# Altium schematic sheet [2] - WIDORA.SchDoc
size A3
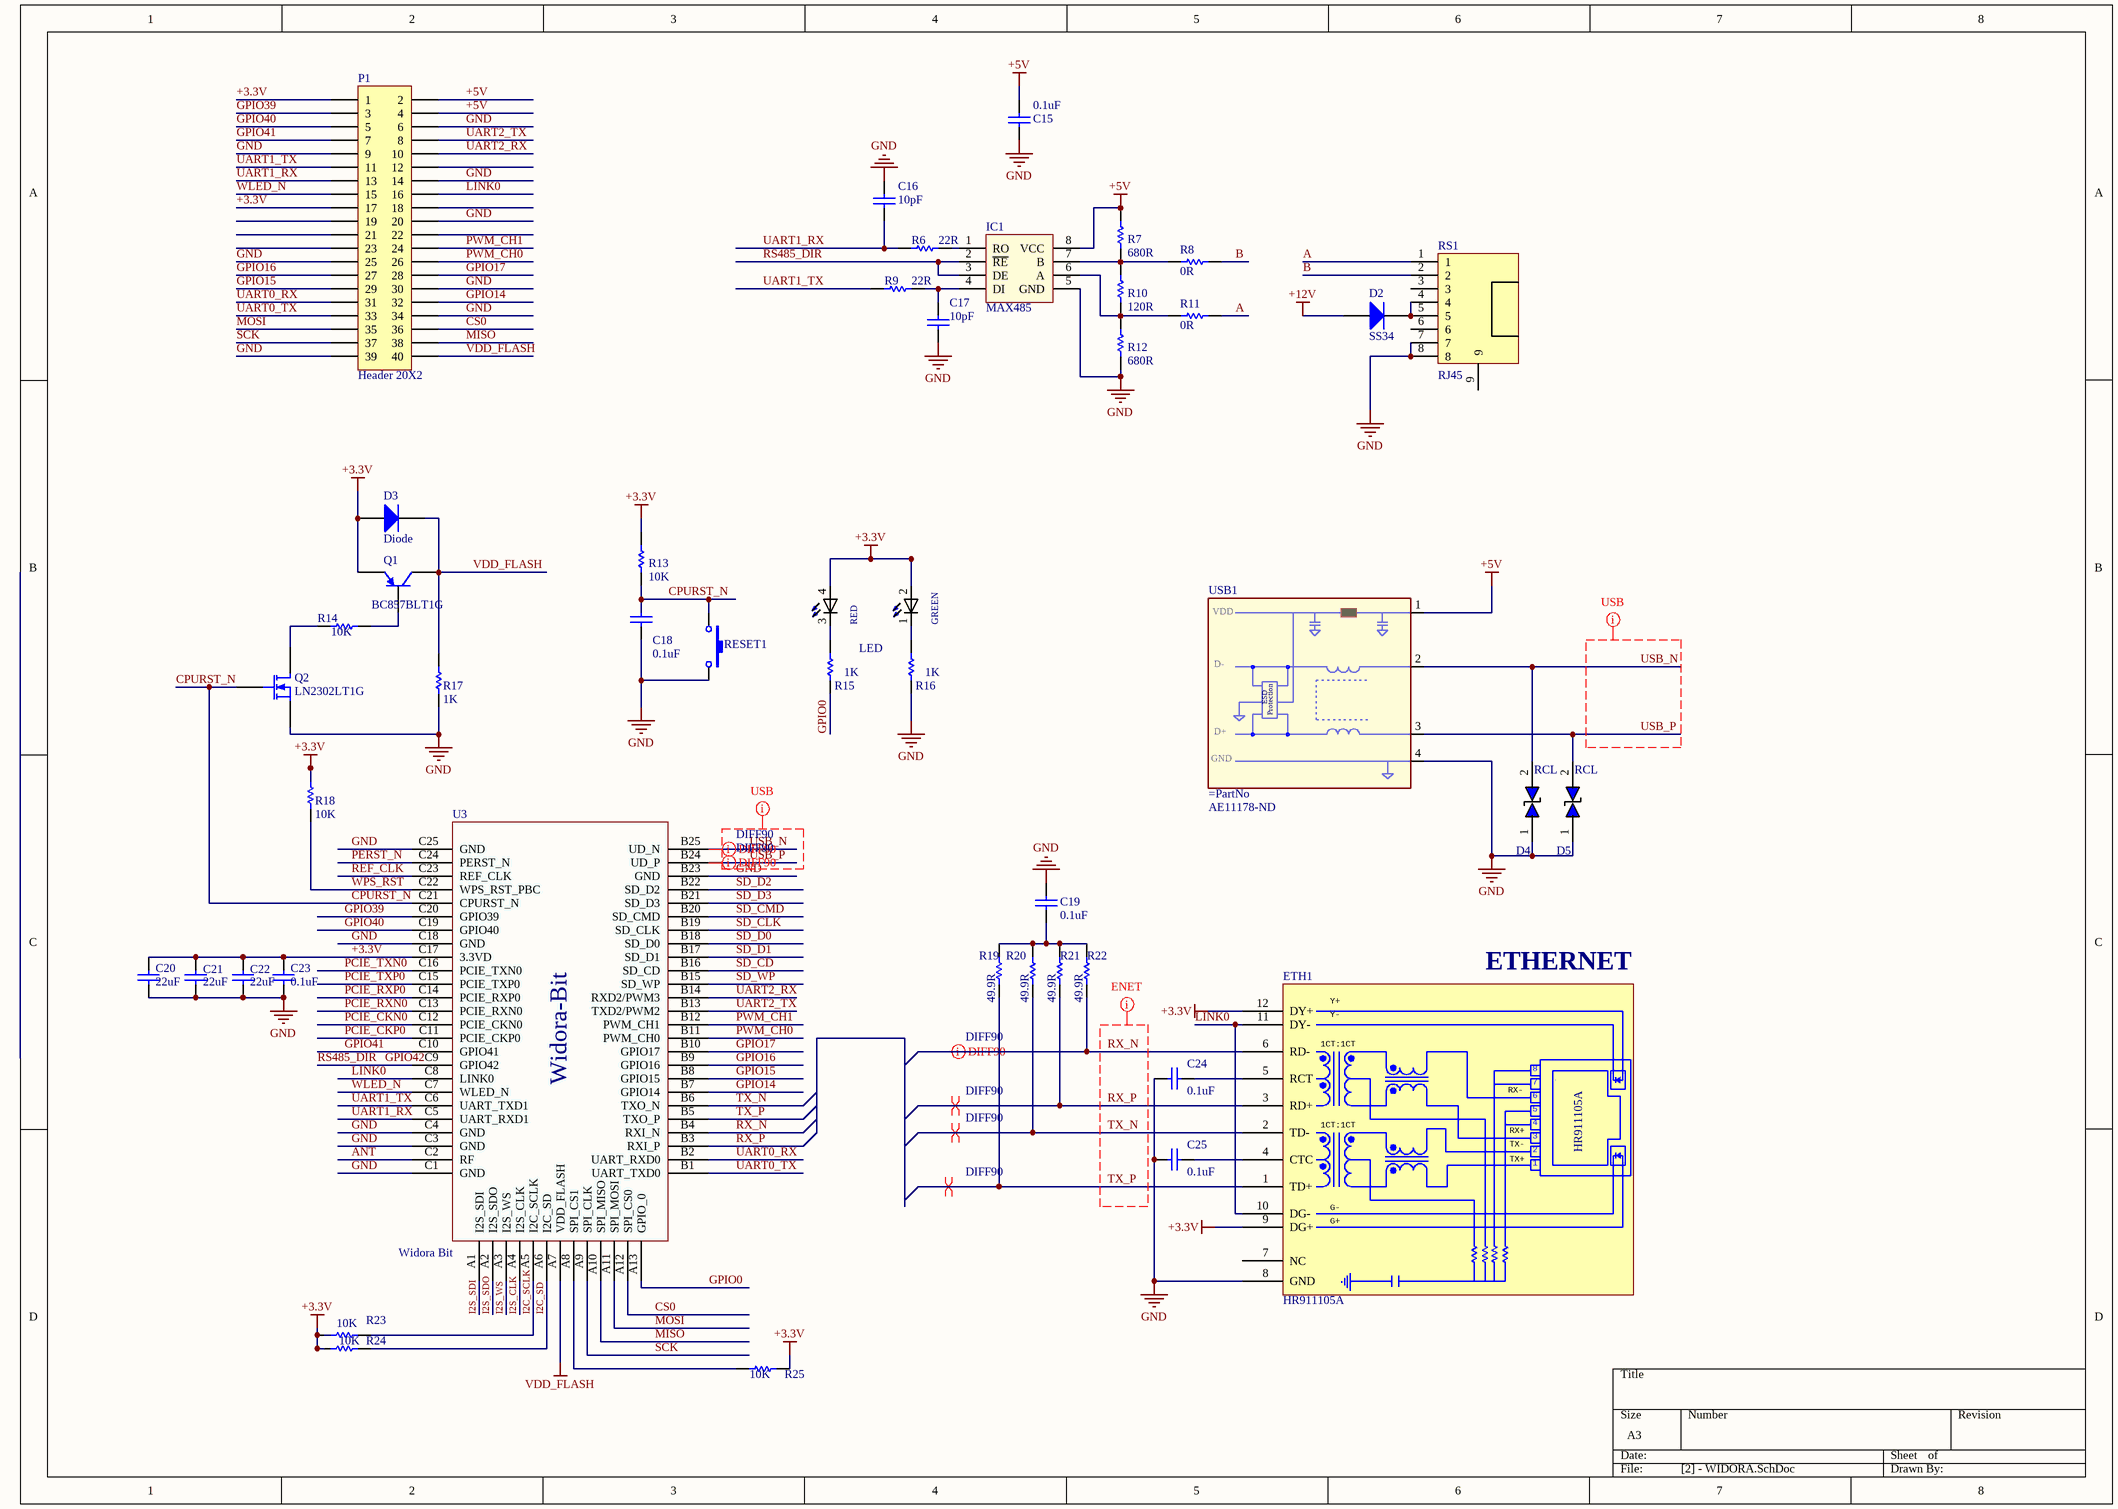
[diagram p0: [2] - WIDORA.SchDoc]

## Parts
C15  0.1uF  [CN-SMD-0603]
C16  10pF  [CN-SMD-0603]
C17  10pF  [CN-SMD-0603]
C18  0.1uF  [CN-SMD-0603]
C19  0.1uF  [CN-SMD-0603]
C20  22uF  [CN-SMD-0805]
C21  22uF  [CN-SMD-0805]
C22  22uF  [CN-SMD-0805]
C23  0.1uF  [CN-SMD-0603]
C24  0.1uF  [CN-SMD-0603]
C25  0.1uF  [CN-SMD-0603]
D2  SS34  [DO-214AC]
D3  Diode  [SOD323]
D4  RCL  [RES-0603]
D5  RCL  [RES-0603]
ETH1  HR911105A  [HR911105A]
IC1  MAX485  [SO8]
LED  122-000-04-52  [*122-000-04-52_122-000-04-52(Primary)]  (value not drawn)
P1  Header 20X2  [HDR2X20]
Q1  BC857BLT1G  [SOT-23B_L]
Q2  LN2302LT1G  [SOT-23B_L]
R6  22R  [RES 0603]
R7  680R  [RES 0603]
R8  0R  [RES 0603]
R9  22R  [RES 0603]
R10  120R  [RES 0603]
R11  0R  [RES 0603]
R12  680R  [RES 0603]
R13  10K  [RES 0603]
R14  10K  [RES 0603]
R15  1K  [RES 0603]
R16  1K  [RES 0603]
R17  1K  [RES 0603]
R18  10K  [RES 0603]
R19  49.9R  [RES 0603]
R20  49.9R  [RES 0603]
R21  49.9R  [RES 0603]
R22  49.9R  [RES 0603]
R23  10K  [RES 0603]
R24  10K  [RES 0603]
R25  10K  [RES 0603]
RESET1  SW-SMD  [SW2-D2 - duplicate]  (value not drawn)
RS1  RJ45  [RJ45_8PIN_VOSAT_V2]
U3  Widora Bit  [WIDORA]
USB1  Supplier Part Number 1: AE11178-ND  [USB A Vertical]

## Nets
+3.3V: C20.2 C21.2 C22.2 C23.1 D3.1(A) ETH1.9(DG+) ETH1.12(DY+) LED.2(GA) LED.4(RA) P1.1 P1.17 Q1.2(E) R13.2 R18.2 R23.2 R24.2 R25.1 U3.C17(3.3VD)
+5V: C15.2 IC1.8(VCC) P1.2 P1.4 R7.2 USB1.1(VBUS)
+12V: D2.1(A)
GND: C15.1 C16.2 C17.2 C18.1 C19.2 C20.1 C21.1 C22.1 C23.2 C24.2 C25.2 D4.1 D5.1 ETH1.8(GND) IC1.5(GND) P1.6 P1.9 P1.14 P1.20 P1.25 P1.30 P1.34 P1.39 Q2.2(S) R12.1 R16.1 R17.1 RESET1.2 RS1.7 RS1.8 U3.B23(GND) U3.C1(GND) U3.C3(GND) U3.C4(GND) U3.C18(GND) U3.C25(GND) USB1.4(GND)
VDD_FLASH: D3.2(K) P1.40 Q1.3(C) R17.2 U3.A7(VDD_FLASH)
A: R11.2 RS1.1
ANT: U3.C2(RF)
B: R8.2 RS1.2
CPURST_N: C18.2 Q2.1(G) R13.1 RESET1.1 U3.C21(CPURST_N)
CS0: P1.36 U3.A12(SPI_CS0)
GPIO0: R15.1 U3.A13(GPIO_0)
GPIO14: P1.32 U3.B7(GPIO14)
GPIO15: P1.29 U3.B8(GPIO15)
GPIO16: P1.27 U3.B9(GPIO16)
GPIO17: P1.28 U3.B10(GPIO17)
GPIO39: P1.3 U3.C20(GPIO39)
GPIO40: P1.5 U3.C19(GPIO40)
GPIO41: P1.7 U3.C10(GPIO41)
GPIO42: IC1.2(~{RE}) IC1.3(DE) U3.C9(GPIO42)  [also labelled RS485_DIR]
I2C_SCLK: R23.1 U3.A5(I2C_SCLK)
I2C_SD: R24.1 U3.A6(I2C_SD)
I2S_CLK: U3.A4(I2S_CLK)
I2S_SDI: U3.A1(I2S_SDI)
I2S_SDO: U3.A2(I2S_SDO)
I2S_WS: U3.A3(I2S_WS)
LINK0: ETH1.10(DG-) ETH1.11(DY-) P1.16 U3.C8(LINK0)
MISO: P1.38 U3.A10(SPI_MISO)
MOSI: P1.35 U3.A11(SPI_MOSI)
PCIE_CKN0: U3.C12(PCIE_CKN0)
PCIE_CKP0: U3.C11(PCIE_CKP0)
PCIE_RXN0: U3.C13(PCIE_RXN0)
PCIE_RXP0: U3.C14(PCIE_RXP0)
PCIE_TXN0: U3.C16(PCIE_TXN0)
PCIE_TXP0: U3.C15(PCIE_TXP0)
PERST_N: U3.C24(PERST_N)
PWM_CH0: P1.26 U3.B11(PWM_CH0)
PWM_CH1: P1.24 U3.B12(PWM_CH1)
REF_CLK: U3.C23(REF_CLK)
RX_N: ETH1.6(RD-) R22.2 U3.B4(RXI_N)
RX_P: ETH1.3(RD+) R21.2 U3.B3(RXI_P)
SCK: P1.37 U3.A9(SPI_CLK)
SD_CD: U3.B16(SD_CD)
SD_CLK: U3.B19(SD_CLK)
SD_CMD: U3.B20(SD_CMD)
SD_D0: U3.B18(SD_D0)
SD_D1: U3.B17(SD_D1)
SD_D2: U3.B22(SD_D2)
SD_D3: U3.B21(SD_D3)
SD_WP: U3.B15(SD_WP)
TX_N: ETH1.2(TD-) R20.2 U3.B6(TXO_N)
TX_P: ETH1.1(TD+) R19.2 U3.B5(TXO_P)
UART0_RX: P1.31 U3.B2(UART_RXD0)
UART0_TX: P1.33 U3.B1(UART_TXD0)
UART1_RX: C16.1 P1.13 R6.2 U3.C5(UART_RXD1)
UART1_TX: P1.11 R9.2 U3.C6(UART_TXD1)
UART2_RX: P1.10 U3.B14(RXD2/PWM3)
UART2_TX: P1.8 U3.B13(TXD2/PWM2)
USB_N: D4.2 U3.B25(UD_N) USB1.2(D-)
USB_P: D5.2 U3.B24(UD_P) USB1.3(D+)
WLED_N: P1.15 U3.C7(WLED_N)
WPS_RST: R18.1 U3.C22(WPS_RST_PBC)
NetC17_1: C17.1 IC1.4(DI) R9.1
NetC19_1: C19.1 R19.1 R20.1 R21.1 R22.1
NetC24_1: C24.1 ETH1.5(RCT)
NetC25_1: C25.1 ETH1.4(CTC)
NetD2_2: D2.2(K) RS1.4 RS1.5
NetIC1_1: IC1.1(RO) R6.1
NetIC1_6: IC1.6(A) R10.1 R11.1 R12.2
NetIC1_7: IC1.7(B) R7.1 R8.1 R10.2
NetLED_1: LED.1(GC) R16.2
NetLED_3: LED.3(RC) R15.2
NetQ1_1: Q1.1(B) R14.2
NetQ2_3: Q2.3(D) R14.1
NetR25_2: R25.2 U3.A8(SPI_CS1)

Not connected (* = marked no-connect by the designer): ETH1 7(NC); P1 12 18 19 21 22 23; RS1 3 6 9

## Layout directives
differential pair; : DIFF90: RX_N, RX_P, TX_N, TX_P, USB_N, USB_P
net class ENET: RX_N, RX_P, TX_N, TX_P
mark named USB: USB_N, USB_P

## Notes on the sheet
- ETHERNET
- (in symbol 122-000-04-52) RED; GREEN
- (in symbol RJ45 - Tranfomer) Y+; Y-; 1CT:1CT; RX-; RX+; TX-; TX+; G-; G+
- (in symbol USB-4) VDD; ESD; Protection
- (in symbol Widora) Widora-Bit

## Library data of the parts
C15 C18 C19 C23-C25 = CN0603-0.1uF: CC0603KPX7R9BB104 0603 0.1 uF 50 V ±10% Tolerance X7R SMT Multilayer Ceramic Capacitor; Manufacturer 1: Yageo; Capacitance: 100nF; Voltage Rating: 50V; Supplier 1: Digi-Key; Manufacturer Part Number 1: CC0603KPX7R9BB104; Stock 1: 190619; Pricing 1: 1=0.10000, 10=0.06200, 100=0.02780, 500=0.01988, 1000=0.01562, 2500=0.01420, 5000=0.01306 (USD); Mount: Surface Mount; Case/Package: 0603; Number of Pins: 2; Weight: 7.1E-05oz; Case Code (Imperial): 0603; Case Code (Metric): 1608; Min Operating Temperature: -55°C; Max Operating Temperature: 125°C; Tolerance: 10%; Packaging: Tape and Reel; Dielectric: X7R; Voltage Rating (DC): 50V; Termination: SMD/SMT; Composition: Ceramic; Length: 1.6mm; Height: 0.8mm; Width: 0.031inch; Thickness: 0.035inch; Depth: 0.8mm; Radiation Hardening: No; Lead Free: Lead Free; Halogen Free: Halogen Free; ComponentLink1URL: https://datasheet.ciiva.com/26829/getdatasheetpartid-653026-26829414.pdf?src-supplier=Verical; ComponentLink1Description: https://datasheet.ciiva.com/26829/getdatasheetpartid-653026-26829414.pdf?src-supplier=Verical; ComponentLink2URL: http://datasheet.octopart.com/CC0603KPX7R9BB104-Yageo-datasheet-10883670.pdf; ComponentLink2Description: http://datasheet.octopart.com/CC0603KPX7R9BB104-Yageo-datasheet-10883670.pdf; ComponentLink3URL: http://datasheet.octopart.com/CC0603KPX7R9BB104-Yageo-datasheet-68298032.pdf?src-supplier=Future+Electronics; ComponentLink3Description: http://datasheet.octopart.com/CC0603KPX7R9BB104-Yageo-datasheet-68298032.pdf?src-supplier=Future+Electronics; ComponentLink4URL: http://datasheet.octopart.com/CC0603KPX7R9BB104-Yageo-datasheet-78855685.pdf?src-supplier=Future+Electronics; ComponentLink4Description: http://datasheet.octopart.com/CC0603KPX7R9BB104-Yageo-datasheet-78855685.pdf?src-supplier=Future+Electronics; ComponentLink5URL: http://datasheet.octopart.com/CC0603KPX7R9BB104-Yageo-datasheet-82288757.pdf?src-supplier=Future+Electronics; ComponentLink5Description: http://datasheet.octopart.com/CC0603KPX7R9BB104-Yageo-datasheet-82288757.pdf?src-supplier=Future+Electronics; ComponentLink6URL: http://datasheet.octopart.com/CC0603KPX7R9BB104-Yageo-datasheet-137700084.pdf?src-supplier=Future+Electronics; ComponentLink6Description: http://datasheet.octopart.com/CC0603KPX7R9BB104-Yageo-datasheet-137700084.pdf?src-supplier=Future+Electronics
C16 C17 = CN0603-10pF: CC0603JRNPO9BN100 Surface Mount Ceramic Multilayer Capacitor 10pF 5% C0G 50V 0603 Paper T/R; Manufacturer 1: Yageo; Insulation Resistance: 100GR; Temperature Coefficient: 30ppm/°C; Supplier 1: Digi-Key; Manufacturer Part Number 1: CC0603JRNPO9BN100; Stock 1: 337373; Pricing 1: 1=0.10000, 10=0.04100, 100=0.01830, 500=0.01310, 1000=0.01029 (USD); Mount: Surface Mount; Case/Package: 0603; Number of Pins: 2; Case Code (Metric): 1608; Case Code (Imperial): 0603; Min Operating Temperature: -55°C; Max Operating Temperature: 125°C; Capacitance: 10pF; Voltage Rating: 50V; Packaging: Tape and Reel; Tolerance: 5%; Dielectric: C0G; Voltage Rating (DC): 50V; Composition: Ceramic; Termination: SMD/SMT; Package Quantity: 1; Voltage: 50V; Length: 1.6mm; Height: 0.8mm; Width: 0.031inch; Thickness: 0.035inch; Depth: 0.8mm; Radiation Hardening: No; Lead Free: Lead Free; REACH SVHC: No SVHC; ComponentLink1URL: https://datasheet.ciiva.com/26862/getdatasheetpartid-403524-26862758.pdf?src-supplier=Verical; ComponentLink1Description: https://datasheet.ciiva.com/26862/getdatasheetpartid-403524-26862758.pdf?src-supplier=Verical; ComponentLink2URL: https://datasheet.ciiva.com/5789/1734582-5789616.pdf?src-supplier=Farnell; ComponentLink2Description: https://datasheet.ciiva.com/5789/1734582-5789616.pdf?src-supplier=Farnell; ComponentLink3URL: https://datasheet.ciiva.com/11786/0900766b8079c870-11786407.pdf?src-supplier=RSComponents; ComponentLink3Description: https://datasheet.ciiva.com/11786/0900766b8079c870-11786407.pdf?src-supplier=RSComponents; ComponentLink4URL: https://datasheet.ciiva.com/144/mlccorderingcode-144651.pdf?src-supplier=Digi-Key; ComponentLink4Description: https://datasheet.ciiva.com/144/mlccorderingcode-144651.pdf?src-supplier=Digi-Key; ComponentLink5URL: https://datasheet.ciiva.com/46430/1835847-46430150.pdf?src-supplier=Element14; ComponentLink5Description: https://datasheet.ciiva.com/46430/1835847-46430150.pdf?src-supplier=Element14; ComponentLink6URL: https://datasheet.ciiva.com/144/mlccorderingcode-144650.pdf?src-supplier=Digi-Key; ComponentLink6Description: https://datasheet.ciiva.com/144/mlccorderingcode-144650.pdf?src-supplier=Digi-Key; ComponentLink7URL: https://datasheet.ciiva.com/8033/1734582-8033706.pdf?src-supplier=Element14; ComponentLink7Description: https://datasheet.ciiva.com/8033/1734582-8033706.pdf?src-supplier=Element14; ComponentLink8URL: https://datasheet.ciiva.com/16625/upy-gp-np0-16v-to-50v-8-16625514.pdf?src-supplier=Avnet+Europe; ComponentLink8Description: https://datasheet.ciiva.com/16625/upy-gp-np0-16v-to-50v-8-16625514.pdf?src-supplier=Avnet+Europe; ComponentLink9URL: https://datasheet.ciiva.com/5425/upy-gp-np0-16v-to-50v-8-5425564.pdf?src-supplier=Mouser; ComponentLink9Description: https://datasheet.ciiva.com/5425/upy-gp-np0-16v-to-50v-8-5425564.pdf?src-supplier=Mouser; ComponentLink10URL: https://datasheet.ciiva.com/7978/1132289-7978126.pdf?src-supplier=Element14; ComponentLink10Description: https://datasheet.ciiva.com/7978/1132289-7978126.pdf?src-supplier=Element14; ComponentLink11URL: https://datasheet.ciiva.com/8033/1734582-8033710.pdf?src-supplier=Element14; ComponentLink11Description: https://datasheet.ciiva.com/8033/1734582-8033710.pdf?src-supplier=Element14; ComponentLink12URL: https://datasheet.ciiva.com/144/mlccorderingcode-144649.pdf?src-supplier=Digi-Key; ComponentLink12Description: https://datasheet.ciiva.com/144/mlccorderingcode-144649.pdf?src-supplier=Digi-Key; ComponentLink13URL: http://datasheet.octopart.com/CC0603JRNPO9BN100-Yageo-datasheet-136957424.pdf?src-supplier=Future+Electronics; ComponentLink13Description: http://datasheet.octopart.com/CC0603JRNPO9BN100-Yageo-datasheet-136957424.pdf?src-supplier=Future+Electronics; ComponentLink14URL: http://datasheet.octopart.com/CC0603JRNPO9BN100-Yageo-datasheet-137700082.pdf?src-supplier=Future+Electronics; ComponentLink14Description: http://datasheet.octopart.com/CC0603JRNPO9BN100-Yageo-datasheet-137700082.pdf?src-supplier=Future+Electronics; ComponentLink15URL: http://datasheet.octopart.com/CC0603JRNPO9BN100-Yageo-datasheet-10406438.pdf?src-supplier=Element14; ComponentLink15Description: http://datasheet.octopart.com/CC0603JRNPO9BN100-Yageo-datasheet-10406438.pdf?src-supplier=Element14; ComponentLink16URL: http://datasheet.octopart.com/CC0603JRNPO9BN100-Yageo-datasheet-504625.pdf?src-supplier=Newark; ComponentLink16Description: http://datasheet.octopart.com/CC0603JRNPO9BN100-Yageo-datasheet-504625.pdf?src-supplier=Newark; ComponentLink17URL: http://datasheet.octopart.com/CC0603JRNPO9BN100-Yageo-datasheet-65873193.pdf?src-supplier=Element14; ComponentLink17Description: http://datasheet.octopart.com/CC0603JRNPO9BN100-Yageo-datasheet-65873193.pdf?src-supplier=Element14; ComponentLink18URL: http://datasheet.octopart.com/CC0603JRNPO9BN100-Yageo-datasheet-10882999.pdf?src-supplier=Element14; ComponentLink18Description: http://datasheet.octopart.com/CC0603JRNPO9BN100-Yageo-datasheet-10882999.pdf?src-supplier=Element14; ComponentLink19URL: http://datasheet.octopart.com/CC0603JRNPO9BN100-Yageo-datasheet-67645495.pdf?src-supplier=Element14; ComponentLink19Description: http://datasheet.octopart.com/CC0603JRNPO9BN100-Yageo-datasheet-67645495.pdf?src-supplier=Element14; ComponentLink20URL: http://datasheet.octopart.com/CC0603JRNPO9BN100-Yageo-datasheet-5321569.pdf?src-supplier=Newark; ComponentLink20Description: http://datasheet.octopart.com/CC0603JRNPO9BN100-Yageo-datasheet-5321569.pdf?src-supplier=Newark; ComponentLink21URL: http://datasheet.octopart.com/CC0603JRNPO9BN100-Yageo-datasheet-15895757.pdf?src-supplier=Future+Electronics; ComponentLink21Description: http://datasheet.octopart.com/CC0603JRNPO9BN100-Yageo-datasheet-15895757.pdf?src-supplier=Future+Electronics; ComponentLink22URL: http://datasheet.octopart.com/CC0603JRNPO9BN100-Yageo-datasheet-24578986.pdf?src-supplier=Future+Electronics; ComponentLink22Description: http://datasheet.octopart.com/CC0603JRNPO9BN100-Yageo-datasheet-24578986.pdf?src-supplier=Future+Electronics; ComponentLink23URL: http://datasheet.octopart.com/CC0603JRNPO9BN100-Yageo-datasheet-8555986.pdf?src-supplier=TME; ComponentLink23Description: http://datasheet.octopart.com/CC0603JRNPO9BN100-Yageo-datasheet-8555986.pdf?src-supplier=TME; ComponentLink24URL: http://datasheet.octopart.com/CC0603JRNPO9BN100-Yageo-datasheet-62091628.pdf?src-supplier=Future+Electronics; ComponentLink24Description: http://datasheet.octopart.com/CC0603JRNPO9BN100-Yageo-datasheet-62091628.pdf?src-supplier=Future+Electronics; ComponentLink25URL: http://datasheet.octopart.com/CC0603JRNPO9BN100-Yageo-datasheet-78855684.pdf?src-supplier=Future+Electronics; ComponentLink25Description: http://datasheet.octopart.com/CC0603JRNPO9BN100-Yageo-datasheet-78855684.pdf?src-supplier=Future+Electronics; ComponentLink26URL: http://datasheet.octopart.com/CC0603JRNPO9BN100-Yageo-datasheet-8324240.pdf?src-supplier=Element14; ComponentLink26Description: http://datasheet.octopart.com/CC0603JRNPO9BN100-Yageo-datasheet-8324240.pdf?src-supplier=Element14; ComponentLink27URL: http://datasheet.octopart.com/CC0603JRNPO9BN100-Yageo-datasheet-8817079.pdf?src-supplier=Element14; ComponentLink27Description: http://datasheet.octopart.com/CC0603JRNPO9BN100-Yageo-datasheet-8817079.pdf?src-supplier=Element14; ComponentLink28URL: http://datasheet.octopart.com/CC0603JRNPO9BN100-Yageo-datasheet-12589826.pdf?src-supplier=Future+Electronics; ComponentLink28Description: http://datasheet.octopart.com/CC0603JRNPO9BN100-Yageo-datasheet-12589826.pdf?src-supplier=Future+Electronics; ComponentLink29URL: http://datasheet.octopart.com/CC0603JRNPO9BN100-Yageo-datasheet-16730043.pdf?src-supplier=Future+Electronics; ComponentLink29Description: http://datasheet.octopart.com/CC0603JRNPO9BN100-Yageo-datasheet-16730043.pdf?src-supplier=Future+Electronics
C20-C22 = CN0805-22uF: CC0805MKX5R6BB226 0805 22 uF 10 V ±20 % Tolerance X5R SMT Multilayer Ceramic Capacitor; Manufacturer 1: Yageo; Tolerance: 20%; Voltage Rating: 10V; Supplier 1: Digi-Key; Manufacturer Part Number 1: CC0805MKX5R6BB226; Stock 1: 18000; Pricing 1: 1=0.41000, 10=0.28800, 100=0.17290, 500=0.12966, 1000=0.10950 (USD); Mount: Surface Mount; Case/Package: 0805; Weight: 0.000194oz; Case Code (Imperial): 0805; Case Code (Metric): 2012; Min Operating Temperature: -55°C; Max Operating Temperature: 85°C; Capacitance: 22uF; Packaging: Tape and Reel; Dielectric: X5R; Voltage Rating (DC): 10V; Termination: SMD/SMT; Composition: Ceramic; Length: 2mm; Width: 1.25mm; Thickness: 0.057inch; Depth: 1.25mm; Radiation Hardening: No; Lead Free: Lead Free; Halogen Free: Halogen Free; ComponentLink1URL: https://datasheet.ciiva.com/26863/getdatasheetpartid-573628-26863004.pdf?src-supplier=Verical; ComponentLink1Description: https://datasheet.ciiva.com/26863/getdatasheetpartid-573628-26863004.pdf?src-supplier=Verical; ComponentLink2URL: http://datasheet.octopart.com/CC0805MKX5R6BB226-Yageo-datasheet-24580494.pdf?src-supplier=Future+Electronics; ComponentLink2Description: http://datasheet.octopart.com/CC0805MKX5R6BB226-Yageo-datasheet-24580494.pdf?src-supplier=Future+Electronics; ComponentLink3URL: http://datasheet.octopart.com/CC0805MKX5R6BB226-Yageo-datasheet-27626583.pdf?src-supplier=Future+Electronics; ComponentLink3Description: http://datasheet.octopart.com/CC0805MKX5R6BB226-Yageo-datasheet-27626583.pdf?src-supplier=Future+Electronics; ComponentLink4URL: http://datasheet.octopart.com/CC0805MKX5R6BB226-Yageo-datasheet-86397281.pdf?src-supplier=Future+Electronics; ComponentLink4Description: http://datasheet.octopart.com/CC0805MKX5R6BB226-Yageo-datasheet-86397281.pdf?src-supplier=Future+Electronics
D2 = Diode_SS34: SS34 DIODE SCHOTTKY 40V 3A SMC; Manufacturer 1: ON Semiconductor / Fairchild; Element Configuration: Single; Peak Reverse Current: 500uA; Max Forward Surge Current (Ifsm): 100A; Forward Voltage: 500mV; Polarity: Standard; Max Power Dissipation: 2.27W; Number of Elements: 1; Supplier 1: Digi-Key; Manufacturer Part Number 1: SS34; Stock 1: 1630; Pricing 1: 1=0.47000, 10=0.40600, 100=0.30310, 500=0.23816, 1000=0.18403 (USD); RoHS: Yes; Mount: Surface Mount; Case/Package: SMC; Number of Pins: 2; Contact Plating: Tin,Matte; Number of Terminals: 2; Min Operating Temperature: -55°C; Max Operating Temperature: 150°C; Packaging: Tape and Reel; Package Quantity: 1; Current Rating: 3A; Voltage Rating (DC): 40V; Forward Current: 3A; Max Repetitive Reverse Voltage (Vrrm): 40V; Output Current: 3A; Peak Non-Repetitive Surge Current: 100A; Average Rectified Current: 3A; Max Reverse Voltage (DC): 40V; Max Surge Current: 100A; Max Reverse Leakage Current: 500uA; Current: 3A; Voltage: 40V; Length: 7.15mm; Height: 2.75mm; Width: 6.25mm; Radiation Hardening: No; Lead Free: Lead Free; REACH SVHC: No SVHC; ComponentLink1URL: https://datasheet.ciiva.com/911/ss34-911088.pdf?src-supplier=Avnet; ComponentLink1Description: https://datasheet.ciiva.com/911/ss34-911088.pdf?src-supplier=Avnet; ComponentLink2URL: https://datasheet.ciiva.com/4715/ss34-197057-4715255.pdf?src-supplier=Mouser; ComponentLink2Description: https://datasheet.ciiva.com/4715/ss34-197057-4715255.pdf?src-supplier=Mouser; ComponentLink3URL: https://datasheet.ciiva.com/34301/1090087-34301975.pdf?src-supplier=Jameco; ComponentLink3Description: https://datasheet.ciiva.com/34301/1090087-34301975.pdf?src-supplier=Jameco; ComponentLink4URL: https://datasheet.ciiva.com/23832/1725604-23832651.pdf?src-supplier=Newark; ComponentLink4Description: https://datasheet.ciiva.com/23832/1725604-23832651.pdf?src-supplier=Newark; ComponentLink5URL: https://datasheet.ciiva.com/34302/1547649-34302462.pdf?src-supplier=Jameco; ComponentLink5Description: https://datasheet.ciiva.com/34302/1547649-34302462.pdf?src-supplier=Jameco; ComponentLink6URL: https://datasheet.ciiva.com/911/ss34-911086.pdf?src-supplier=Digi-Key; ComponentLink6Description: https://datasheet.ciiva.com/911/ss34-911086.pdf?src-supplier=Digi-Key; ComponentLink7URL: https://datasheet.ciiva.com/8300/ss39-8300583.pdf?src-supplier=Avnet; ComponentLink7Description: https://datasheet.ciiva.com/8300/ss39-8300583.pdf?src-supplier=Avnet; ComponentLink8URL: https://datasheet.ciiva.com/911/ss34-911085.pdf?src-supplier=Digi-Key; ComponentLink8Description: https://datasheet.ciiva.com/911/ss34-911085.pdf?src-supplier=Digi-Key; ComponentLink9URL: https://datasheet.ciiva.com/7965/1774678-7965245.pdf?src-supplier=Element14; ComponentLink9Description: https://datasheet.ciiva.com/7965/1774678-7965245.pdf?src-supplier=Element14; ComponentLink10URL: https://datasheet.ciiva.com/911/ss34-911087.pdf?src-supplier=Digi-Key; ComponentLink10Description: https://datasheet.ciiva.com/911/ss34-911087.pdf?src-supplier=Digi-Key
D3 = Diode: Default Diode; pin to pad: 1>A 2>K; Published: 8-Jun-2000; LatestRevisionDate: 17-Jul-2002; LatestRevisionNote: Re-released for DXP Platform.; PackageVersion: Sep-1996; PackageReference: SMC; Publisher: Altium Limited; Code_JEDEC: DO-214-AB
D4 D5 = RCLAMP0531TQTCT: ESD Suppressor TVS Â±20KV 2-Pin SLP1006P2T T/R; MF: Semtech Corporation; MP: RCLAMP0531TQTCT; Package: 0402 Semtech; Availability: Unavailable; SnapEDA_Link: https://www.snapeda.com/parts/RCLAMP0531TQTCT/Semtech%20Corporation/view-part/?ref=snap; Price: None; Value: *
ETH1 = RJ45 - Tranfomer: Manufacturer: Hanrun; Suppiler 1: China; Manufacturer Part Number: HR911105A; Suppiler Part Number 1: HR911105A
IC1 = MAX485: RS232 - RS485 (Same sn75176)
LED = 122-000-04-52: LED, 3MM, PCB, BI-LEVEL, RED/GRN; LED / Lamp Size: 3mm / T-1; LED Colour: Green, Red; Viewing Angle: 30Â°; Forward Cur...; MF: Marl; Package: None; Availability: Unavailable; SnapEDA_Link: https://www.snapeda.com/parts/122-000-04-52/Marl/view-part/?ref=snap; Price: None; MP: 122-000-04-52; Value: *
P1 = Header 20X2: Header, 20-Pin, Dual row; LatestRevisionDate: 17-Jul-2002; LatestRevisionNote: Re-released for DXP Platform.; Publisher: Altium Limited
Q1 = BC857BLT1G: PNP Bipolar Transistor; Manufacturer: ON Semiconductor; Manufacturer Part Number: SBC857BLT1G; Max Power Dissipation: 300mW; Collector Emitter Voltage (VCEO): 45V; Max Collector Current: 100mA; Collector Base Voltage (VCBO): 50V; Frequency: 100MHz; Number of Elements: 1; Emitter Base Voltage (VEBO): 5V; Collector Emitter Saturation Voltage: -650mV; Element Configuration: Single; Supplier 1: Digi-Key; Stock 1: 19102; Pricing 1: 1 = 0.37000, 10 = 0.30200, 100 = 0.16030, 500 = 0.10544, 1000 = 0.07170 (USD); Case/Package: SOT-23-3; Number of Pins: 3; Min Operating Temperature: -55°C; Max Operating Temperature: 150°C; Package Quantity: 3000; Packaging: Tape and Reel; Transition Frequency: 100MHz; Polarity: PNP; Collector Emitter Breakdown Voltage: 45V; Max Breakdown Voltage: 45V; Power Dissipation: 300mW; Max Frequency: 100MHz; Length: 3.04mm; Height: 1.11mm; Width: 2.64mm; Radiation Hardening: No; Lead Free: Lead Free; ComponentLink1URL: https://datasheet.ciiva.com/16289/bc856alt1-d-91438-16289793.pdf?src-supplier=Mouser; ComponentLink1Description: https://datasheet.ciiva.com/16289/bc856alt1-d-91438-16289793.pdf?src-supplier=Mouser; ComponentLink2URL: https://datasheet.ciiva.com/980/bc856alt1-d-980919.pdf?src-supplier=Digi-Key; ComponentLink2Description: https://datasheet.ciiva.com/980/bc856alt1-d-980919.pdf?src-supplier=Digi-Key; ComponentLink3URL: https://datasheet.ciiva.com/11204/bc856alt1-d-11204892.pdf?src-supplier=Avnet; ComponentLink3Description: https://datasheet.ciiva.com/11204/bc856alt1-d-11204892.pdf?src-supplier=Avnet; ComponentLink4URL: http://datasheet.octopart.com/SBC857BLT1G-ON-Semiconductor-datasheet-547021.pdf?src-supplier=Future+Electronics; ComponentLink4Description: http://datasheet.octopart.com/SBC857BLT1G-ON-Semiconductor-datasheet-547021.pdf?src-supplier=Future+Electronics; ComponentLink5URL: http://datasheet.octopart.com/SBC857BLT1G-ON-Semiconductor-datasheet-7834531.pdf?src-supplier=Future+Electronics; ComponentLink5Description: http://datasheet.octopart.com/SBC857BLT1G-ON-Semiconductor-datasheet-7834531.pdf?src-supplier=Future+Electronics; ComponentLink6URL: http://datasheet.octopart.com/SBC857BLT1G-ON-Semiconductor-datasheet-522530.pdf?src-supplier=ON+Semiconductor; ComponentLink6Description: http://datasheet.octopart.com/SBC857BLT1G-ON-Semiconductor-datasheet-522530.pdf?src-supplier=ON+Semiconductor; ComponentLink7URL: http://datasheet.octopart.com/SBC857BLT1G-ON-Semiconductor-datasheet-24993137.pdf?src-supplier=Element14; ComponentLink7Description: http://datasheet.octopart.com/SBC857BLT1G-ON-Semiconductor-datasheet-24993137.pdf?src-supplier=Element14; ComponentLink8URL: http://datasheet.octopart.com/SBC857BLT1G-ON-Semiconductor-datasheet-11547404.pdf?src-supplier=Future+Electronics; ComponentLink8Description: http://datasheet.octopart.com/SBC857BLT1G-ON-Semiconductor-datasheet-11547404.pdf?src-supplier=Future+Electronics; Supplier Part Number 1: SBC857BLT1GOSCT-ND
Q2 = MOSFET-N: N-Channel MOSFET; Manufacturer: LRC; Suppiler 1: China; Manufacturer Part Number: LN2302LT1G; Suppiler Part Number 1: LN2302LT1G; Case/Package: SOT-23
R6 R9 = RC0603_22R: 311-22GRCT-ND Res Thick Film 0603 22 Ohm 5% 0.1W(1/10W) ±100ppm/C Pad SMD T/R; Manufacturer 1: Yageo; Manufacturer Part Number 1: RC0603JR-0722RL; Voltage Rating: 50V; Temperature Coefficient: 100ppm/°C; Power Rating: 100mW; Supplier 1: Digi-Key; Stock 1: 3749192; Pricing 1: 1=0.10000, 10=0.01900, 100=0.00770, 1000=0.00347, 2500=0.00301 (USD); Case/Package: 0603; Number of Pins: 2; Case Code (Imperial): 0603; Case Code (Metric): 1608; Min Operating Temperature: -55°C; Max Operating Temperature: 155°C; Tolerance: 5%; Packaging: Tape and Reel; Termination: SMD/SMT; Voltage Rating (DC): 50V; Composition: Thick Film; Resistance: 22R; Military Standard: Not; Length: 1.6mm; Width: 0.8mm; Depth: 0.8mm; Lead Free: Lead Free; REACH SVHC: No SVHC; ComponentLink1URL: https://datasheet.ciiva.com/15189/getdatasheetpartid-493085-15189862.pdf?src-supplier=Verical; ComponentLink1Description: https://datasheet.ciiva.com/15189/getdatasheetpartid-493085-15189862.pdf?src-supplier=Verical; ComponentLink2URL: https://datasheet.ciiva.com/7746/443971-7746471.pdf?src-supplier=Element14; ComponentLink2Description: https://datasheet.ciiva.com/7746/443971-7746471.pdf?src-supplier=Element14; ComponentLink3URL: https://datasheet.ciiva.com/46394/443971-46394999.pdf?src-supplier=Element14; ComponentLink3Description: https://datasheet.ciiva.com/46394/443971-46394999.pdf?src-supplier=Element14; ComponentLink4URL: https://datasheet.ciiva.com/7746/443971-7746472.pdf?src-supplier=Element14; ComponentLink4Description: https://datasheet.ciiva.com/7746/443971-7746472.pdf?src-supplier=Element14; ComponentLink5URL: http://datasheet.octopart.com/RC0603JR-0722RL-Yageo-datasheet-137700087.pdf?src-supplier=Future+Electronics; ComponentLink5Description: http://datasheet.octopart.com/RC0603JR-0722RL-Yageo-datasheet-137700087.pdf?src-supplier=Future+Electronics; ComponentLink6URL: http://datasheet.octopart.com/RC0603JR-0722RL-Yageo-datasheet-8328172.pdf?src-supplier=Newark; ComponentLink6Description: http://datasheet.octopart.com/RC0603JR-0722RL-Yageo-datasheet-8328172.pdf?src-supplier=Newark; ComponentLink7URL: http://datasheet.octopart.com/RC0603JR-0722RL-Yageo-datasheet-34211833.pdf?src-supplier=Newark; ComponentLink7Description: http://datasheet.octopart.com/RC0603JR-0722RL-Yageo-datasheet-34211833.pdf?src-supplier=Newark; ComponentLink8URL: http://datasheet.octopart.com/RC0603JR-0722RL-Yageo-datasheet-62067350.pdf?src-supplier=Element14; ComponentLink8Description: http://datasheet.octopart.com/RC0603JR-0722RL-Yageo-datasheet-62067350.pdf?src-supplier=Element14; ComponentLink9URL: http://datasheet.octopart.com/RC0603JR-0722RL-Yageo-datasheet-15599030.pdf?src-supplier=Seeed+Studio; ComponentLink9Description: http://datasheet.octopart.com/RC0603JR-0722RL-Yageo-datasheet-15599030.pdf?src-supplier=Seeed+Studio; ComponentLink10URL: http://datasheet.octopart.com/RC0603JR-0722RL-Yageo-datasheet-73766026.pdf; ComponentLink10Description: http://datasheet.octopart.com/RC0603JR-0722RL-Yageo-datasheet-73766026.pdf; ComponentLink11URL: http://datasheet.octopart.com/RC0603JR-0722RL-Yageo-datasheet-118562.pdf?src-supplier=Digi-Key; ComponentLink11Description: http://datasheet.octopart.com/RC0603JR-0722RL-Yageo-datasheet-118562.pdf?src-supplier=Digi-Key; ComponentLink12URL: http://datasheet.octopart.com/RC0603JR-0722RL-Yageo-datasheet-8324193.pdf?src-supplier=Future+Electronics; ComponentLink12Description: http://datasheet.octopart.com/RC0603JR-0722RL-Yageo-datasheet-8324193.pdf?src-supplier=Future+Electronics; ComponentLink13URL: http://datasheet.octopart.com/RC0603JR-0722RL-Yageo-datasheet-12596169.pdf?src-supplier=Future+Electronics; ComponentLink13Description: http://datasheet.octopart.com/RC0603JR-0722RL-Yageo-datasheet-12596169.pdf?src-supplier=Future+Electronics; ComponentLink14URL: http://datasheet.octopart.com/RC0603JR0722RL-Yageo-datasheet-27584510.pdf?src-supplier=Future+Electronics; ComponentLink14Description: http://datasheet.octopart.com/RC0603JR0722RL-Yageo-datasheet-27584510.pdf?src-supplier=Future+Electronics
R7 R12 = RC0603_680R: AC0603JR-07680RL Res Thick Film 0603 680 Ohm 5% 0.1W(1/10W) +/-100ppm/ßC Epoxy SMD Automotive T/R; Manufacturer 1: Yageo; Voltage Rating: 50V; Temperature Coefficient: 100ppm/°C; Max Power Dissipation: 100mW; Supplier 1: Digi-Key; Manufacturer Part Number 1: AC0603JR-07680RL; Stock 1: 5000; Pricing 1: 1=0.10000, 10=0.02300, 100=0.00940, 1000=0.00421, 2500=0.00366 (USD); Case/Package: 0603; Case Code (Imperial): 0603; Case Code (Metric): 1608; Contact Plating: Tin; Min Operating Temperature: -55°C; Max Operating Temperature: 155°C; Packaging: Tape and Reel; Tolerance: 5%; Termination: SMD/SMT; Composition: Thick Film; Resistance: 680R; Number of Terminations: 2; Features: Moisture Resistant; Power Rating: 100mW; Package Quantity: 1; Length: 0.063inch; Height: 0.022inch; Width: 0.8mm; Radiation Hardening: No; Lead Free: Lead Free; ComponentLink1URL: http://www.yageo.com/documents/recent/PYu-AC_51_RoHS_L_2.pdf?src-supplier=Mouser; ComponentLink1Description: http://www.yageo.com/documents/recent/PYu-AC_51_RoHS_L_2.pdf?src-supplier=Mouser; ComponentLink2URL: http://www.yageo.com/documents/recent/PYu-AC_51_RoHS_L_2_revised.pdf?src-supplier=Avnet+Europe; ComponentLink2Description: http://www.yageo.com/documents/recent/PYu-AC_51_RoHS_L_2_revised.pdf?src-supplier=Avnet+Europe; ComponentLink3URL: http://www.yageo.com/NewPortal/yageodocoutput?fileName=/pdf/R-Chip/PYu-AC_51_RoHS_L_6.pdf&src-supplier=Digi-Key; ComponentLink3Description: http://www.yageo.com/NewPortal/yageodocoutput?fileName=/pdf/R-Chip/PYu-AC_51_RoHS_L_6.pdf&src-supplier=Digi-Key; ComponentLink4URL: http://datasheet.octopart.com/AC0603JR-07680RL-Yageo-datasheet-12512238.pdf; ComponentLink4Description: http://datasheet.octopart.com/AC0603JR-07680RL-Yageo-datasheet-12512238.pdf; ComponentLink5URL: http://datasheet.octopart.com/AC0603JR-07680RL-Yageo-datasheet-86786639.pdf?src-supplier=Future+Electronics; ComponentLink5Description: http://datasheet.octopart.com/AC0603JR-07680RL-Yageo-datasheet-86786639.pdf?src-supplier=Future+Electronics; ComponentLink6URL: http://datasheet.octopart.com/AC0603JR-07680RL-Yageo-datasheet-128680548.pdf?src-supplier=X-ON; ComponentLink6Description: http://datasheet.octopart.com/AC0603JR-07680RL-Yageo-datasheet-128680548.pdf?src-supplier=X-ON; ComponentLink7URL: http://datasheet.octopart.com/AC0603JR-07680RL-Yageo-datasheet-137699919.pdf?src-supplier=Future+Electronics; ComponentLink7Description: http://datasheet.octopart.com/AC0603JR-07680RL-Yageo-datasheet-137699919.pdf?src-supplier=Future+Electronics
R8 R11 = RC0603_0R: AC0603JR-070RL Res Thick Film 0603 0 Ohm Jumper 1/10W Molded SMD Paper T/R; Manufacturer 1: Yageo; Resistance: 0mR; Tolerance: 1%; Power Rating: 100mW; Supplier 1: Digi-Key; Manufacturer Part Number 1: AC0603JR-070RL; Stock 1: 966373; Pricing 1: 1=0.10000, 10=0.02500, 25=0.01840, 50=0.01400, 100=0.01030, 250=0.00788, 500=0.00630, 1000=0.00463 (USD); Case/Package: 0603; Weight: 7.1E-05oz; Case Code (Metric): 1608; Case Code (Imperial): 0603; Min Operating Temperature: -55°C; Max Operating Temperature: 155°C; Packaging: Tape and Reel; Package Quantity: 1; Termination: SMD/SMT; Military Standard: Not; Composition: Thick Film; Number of Terminations: 2; Max Power Dissipation: 100mW; Features: Moisture Resistant; Length: 1.6mm; Height: 0.022inch; Width: 0.031inch; Depth: 0.8mm; Lead Free: Lead Free; ComponentLink1URL: https://datasheet.ciiva.com/5558/pyu-ac-51-rohs-l-2-5558237.pdf?src-supplier=Mouser; ComponentLink1Description: https://datasheet.ciiva.com/5558/pyu-ac-51-rohs-l-2-5558237.pdf?src-supplier=Mouser; ComponentLink2URL: http://datasheet.octopart.com/AC0603JR-070RL-Yageo-datasheet-12512238.pdf; ComponentLink2Description: http://datasheet.octopart.com/AC0603JR-070RL-Yageo-datasheet-12512238.pdf; ComponentLink3URL: http://datasheet.octopart.com/AC0603JR-070RL-Yageo-datasheet-13029202.pdf?src-supplier=Future+Electronics; ComponentLink3Description: http://datasheet.octopart.com/AC0603JR-070RL-Yageo-datasheet-13029202.pdf?src-supplier=Future+Electronics; ComponentLink4URL: http://datasheet.octopart.com/AC0603JR-070RL-Yageo-datasheet-24580492.pdf?src-supplier=Future+Electronics; ComponentLink4Description: http://datasheet.octopart.com/AC0603JR-070RL-Yageo-datasheet-24580492.pdf?src-supplier=Future+Electronics; ComponentLink5URL: http://datasheet.octopart.com/AC0603JR-070RL-Yageo-datasheet-83209224.pdf?src-supplier=Future+Electronics; ComponentLink5Description: http://datasheet.octopart.com/AC0603JR-070RL-Yageo-datasheet-83209224.pdf?src-supplier=Future+Electronics; ComponentLink6URL: http://datasheet.octopart.com/AC0603JR-070RL-Yageo-datasheet-137699919.pdf?src-supplier=Future+Electronics; ComponentLink6Description: http://datasheet.octopart.com/AC0603JR-070RL-Yageo-datasheet-137699919.pdf?src-supplier=Future+Electronics; Supplier Part Number 1: 0R
R10 = RC0603_120R: RC0603JR-07120RL Res Thick Film 0603 120 Ohm 5% 0.1W(1/10W) ±100ppm/C Pad SMD T/R; Manufacturer 1: Yageo; Voltage Rating (DC): 50V; Temperature Coefficient: 100ppm/°C; Power Rating: 100mW; Supplier 1: Newark; Manufacturer Part Number 1: RC0603JR-07120RL; Stock 1: 21749; Pricing 1: 1=0.100000, 10=0.100000, 25=0.015000, 50=0.010000, 100=0.005000, 250=0.005000, 500=0.004000, 1000=0.004000 (USD); Case/Package: 0603; Number of Pins: 2; Case Code (Metric): 1608; Case Code (Imperial): 0603; Min Operating Temperature: -55°C; Max Operating Temperature: 155°C; Tolerance: 5%; Packaging: Tape and Reel; Composition: Thick Film; Termination: SMD/SMT; Voltage Rating: 50V; Resistance: 120R; Package Quantity: 1; Number of Terminations: 2; Max Power Dissipation: 100mW; Military Standard: Not; Features: Moisture Resistant; Length: 1.6mm; Height: 0.022inch; Width: 0.8mm; Depth: 0.8mm; Lead Free: Lead Free; REACH SVHC: No SVHC; ComponentLink1URL: https://datasheet.ciiva.com/15189/getdatasheetpartid-326532-15189850.pdf?src-supplier=Verical; ComponentLink1Description: https://datasheet.ciiva.com/15189/getdatasheetpartid-326532-15189850.pdf?src-supplier=Verical; ComponentLink2URL: https://datasheet.ciiva.com/2518/pyu-r-int-thick-7-2518850.pdf?src-supplier=Digi-Key; ComponentLink2Description: https://datasheet.ciiva.com/2518/pyu-r-int-thick-7-2518850.pdf?src-supplier=Digi-Key; ComponentLink3URL: https://datasheet.ciiva.com/2518/pyu-r-int-thick-7-2518851.pdf?src-supplier=Digi-Key; ComponentLink3Description: https://datasheet.ciiva.com/2518/pyu-r-int-thick-7-2518851.pdf?src-supplier=Digi-Key; ComponentLink4URL: https://datasheet.ciiva.com/2518/pyu-r-int-thick-7-2518852.pdf?src-supplier=Digi-Key; ComponentLink4Description: https://datasheet.ciiva.com/2518/pyu-r-int-thick-7-2518852.pdf?src-supplier=Digi-Key; ComponentLink5URL: https://datasheet.ciiva.com/12555/rc0603-272842-12555246.pdf?src-supplier=Mouser; ComponentLink5Description: https://datasheet.ciiva.com/12555/rc0603-272842-12555246.pdf?src-supplier=Mouser; ComponentLink6URL: https://datasheet.ciiva.com/46395/443971-46395070.pdf?src-supplier=Element14; ComponentLink6Description: https://datasheet.ciiva.com/46395/443971-46395070.pdf?src-supplier=Element14; ComponentLink7URL: http://datasheet.octopart.com/RC0603JR-07120RL-Yageo-datasheet-137700087.pdf?src-supplier=Future+Electronics; ComponentLink7Description: http://datasheet.octopart.com/RC0603JR-07120RL-Yageo-datasheet-137700087.pdf?src-supplier=Future+Electronics; ComponentLink8URL: http://datasheet.octopart.com/RC0603JR-07120RL-Yageo-datasheet-8328172.pdf?src-supplier=Newark; ComponentLink8Description: http://datasheet.octopart.com/RC0603JR-07120RL-Yageo-datasheet-8328172.pdf?src-supplier=Newark; ComponentLink9URL: http://datasheet.octopart.com/RC0603JR-07120RL-Yageo-datasheet-62067350.pdf?src-supplier=Element14; ComponentLink9Description: http://datasheet.octopart.com/RC0603JR-07120RL-Yageo-datasheet-62067350.pdf?src-supplier=Element14; ComponentLink10URL: http://datasheet.octopart.com/RC0603JR-07120RL-Yageo-datasheet-34211833.pdf?src-supplier=Element14; ComponentLink10Description: http://datasheet.octopart.com/RC0603JR-07120RL-Yageo-datasheet-34211833.pdf?src-supplier=Element14; ComponentLink11URL: http://datasheet.octopart.com/RC0603JR-07120RL-Yageo-datasheet-12596169.pdf?src-supplier=Future+Electronics; ComponentLink11Description: http://datasheet.octopart.com/RC0603JR-07120RL-Yageo-datasheet-12596169.pdf?src-supplier=Future+Electronics; ComponentLink12URL: http://datasheet.octopart.com/RC0603JR-07120RL-Yageo-datasheet-27584510.pdf?src-supplier=Future+Electronics; ComponentLink12Description: http://datasheet.octopart.com/RC0603JR-07120RL-Yageo-datasheet-27584510.pdf?src-supplier=Future+Electronics; ComponentLink13URL: http://datasheet.octopart.com/RC0603JR-07120RL-Yageo-datasheet-73766026.pdf; ComponentLink13Description: http://datasheet.octopart.com/RC0603JR-07120RL-Yageo-datasheet-73766026.pdf; ComponentLink14URL: http://datasheet.octopart.com/RC0603JR-07120RL-Yageo-datasheet-118562.pdf?src-supplier=Digi-Key; ComponentLink14Description: http://datasheet.octopart.com/RC0603JR-07120RL-Yageo-datasheet-118562.pdf?src-supplier=Digi-Key; ComponentLink15URL: http://datasheet.octopart.com/RC0603JR-07120RL-Yageo-datasheet-8324193.pdf?src-supplier=Future+Electronics; ComponentLink15Description: http://datasheet.octopart.com/RC0603JR-07120RL-Yageo-datasheet-8324193.pdf?src-supplier=Future+Electronics; ComponentLink16URL: http://datasheet.octopart.com/RC0603JR-07120RL-Yageo-datasheet-15599030.pdf?src-supplier=Future+Electronics; ComponentLink16Description: http://datasheet.octopart.com/RC0603JR-07120RL-Yageo-datasheet-15599030.pdf?src-supplier=Future+Electronics
R13 R14 R18 R23-R25 = RC0603_10K: AC0603FR-0710KL Res Thick Film 0603 10K Ohm 1% 0.1W(1/10W) ±100ppm/C Pad SMD Automotive T/R; Manufacturer 1: Yageo; Resistance: 10kR; Temperature Coefficient: 100ppm/°C; Power Rating: 100mW; Voltage Rating: 50V; ComponentLink1URL: https://datasheet.ciiva.com/26862/getdatasheetpartid-724997-26862461.pdf?src-supplier=Verical; ComponentLink1Description: https://datasheet.ciiva.com/26862/getdatasheetpartid-724997-26862461.pdf?src-supplier=Verical; ComponentLink2URL: http://datasheet.octopart.com/AC0603FR-0710KL-Yageo-datasheet-12512238.pdf; ComponentLink2Description: http://datasheet.octopart.com/AC0603FR-0710KL-Yageo-datasheet-12512238.pdf; ComponentLink3URL: http://datasheet.octopart.com/AC0603FR-0710KL-Yageo-datasheet-13029202.pdf?src-supplier=Future+Electronics; ComponentLink3Description: http://datasheet.octopart.com/AC0603FR-0710KL-Yageo-datasheet-13029202.pdf?src-supplier=Future+Electronics; ComponentLink4URL: http://datasheet.octopart.com/AC0603FR-0710KL-Yageo-datasheet-24580492.pdf?src-supplier=Future+Electronics; ComponentLink4Description: http://datasheet.octopart.com/AC0603FR-0710KL-Yageo-datasheet-24580492.pdf?src-supplier=Future+Electronics; ComponentLink5URL: http://datasheet.octopart.com/AC0603FR-0710KL-Yageo-datasheet-137699919.pdf?src-supplier=Future+Electronics; ComponentLink5Description: http://datasheet.octopart.com/AC0603FR-0710KL-Yageo-datasheet-137699919.pdf?src-supplier=Future+Electronics; Supplier 1: Newark; Manufacturer Part Number 1: AC0603FR-0710KL; Stock 1: 0; Mount: Surface Mount; Case/Package: 0603; Case Code (Imperial): 0603; Case Code (Metric): 1608; Min Operating Temperature: -55°C; Max Operating Temperature: 155°C; Tolerance: 1%; Packaging: Tape and Reel; Military Standard: Not; Termination: SMD/SMT; Composition: Thick Film; Package Quantity: 1; Number of Terminations: 2; Max Power Dissipation: 100mW; Features: Moisture Resistant; Length: 1.6mm; Height: 0.022inch; Depth: 0.8mm; Width: 0.8mm; Lead Free: Lead Free; Supplier Part Number 1: 10K
R15-R17 = RC0603_1K: YC164-JR-071KL Res Thick Film Array 1KOhm 5% 200ppm/C ISOL Epoxy 8-Pin 1206(4 X 0603) Convex SMD T/R; Manufacturer 1: Yageo; Resistance: 1kR; Temperature Coefficient: 200ppm/°C; Voltage Rating: 50V; Number of Elements: 4; Circuit Type: Isolated; Power Per Element: 62.5mW; Number of Contacts: 8; ComponentLink1URL: https://datasheet.ciiva.com/28379/pyu-yc-tc164-51-rohs-l-3-28379349.pdf?src-supplier=Avnet+Europe; ComponentLink1Description: https://datasheet.ciiva.com/28379/pyu-yc-tc164-51-rohs-l-3-28379349.pdf?src-supplier=Avnet+Europe; ComponentLink2URL: https://datasheet.ciiva.com/2694/pyu-yc-tc164-51-rohs-l-3-2694464.pdf?src-supplier=Digi-Key; ComponentLink2Description: https://datasheet.ciiva.com/2694/pyu-yc-tc164-51-rohs-l-3-2694464.pdf?src-supplier=Digi-Key; ComponentLink3URL: https://datasheet.ciiva.com/7620/443424-7620735.pdf?src-supplier=Element14; ComponentLink3Description: https://datasheet.ciiva.com/7620/443424-7620735.pdf?src-supplier=Element14; ComponentLink4URL: https://datasheet.ciiva.com/2694/pyu-yc-tc164-51-rohs-l-3-2694465.pdf?src-supplier=Digi-Key; ComponentLink4Description: https://datasheet.ciiva.com/2694/pyu-yc-tc164-51-rohs-l-3-2694465.pdf?src-supplier=Digi-Key; ComponentLink5URL: https://datasheet.ciiva.com/2694/pyu-yc-tc164-51-rohs-l-3-2694463.pdf?src-supplier=Digi-Key; ComponentLink5Description: https://datasheet.ciiva.com/2694/pyu-yc-tc164-51-rohs-l-3-2694463.pdf?src-supplier=Digi-Key; Supplier 1: Digi-Key; Manufacturer Part Number 1: YC164-JR-071KL; Stock 1: 380579; Mount: Surface Mount; Case/Package: 0603; Case Code (Imperial): 1206; Case Code (Metric): 3216; Min Operating Temperature: -55°C; Max Operating Temperature: 155°C; Tolerance: 5%; Packaging: Cut Tape; Military Standard: Not; Termination: Convex; Package Quantity: 1; Length: 0.126inch; Height: 0.028inch; Depth: 1.6mm; Width: 0.063inch; Lead Free: Lead Free; Pricing 1: 1=0.11000, 10=0.09600, 25=0.06640, 50=0.05180, 100=0.03700, 250=0.02884, 500=0.02290, 1000=0.01626 (USD); Number of Pins: 8; Number of Terminals: 8; Number of Resistors: 4; Working Voltage: 50V; Number of Circuits: 4; Power Dissipation: 62.5mW; Terminal Pitch: 0.8mm; Radiation Hardening: No; REACH SVHC: Unknown; ComponentLink6URL: https://datasheet.ciiva.com/17051/pyu-yc-tc164-51-rohs-l-3-17051807.pdf?src-supplier=Future+Electronics; ComponentLink6Description: https://datasheet.ciiva.com/17051/pyu-yc-tc164-51-rohs-l-3-17051807.pdf?src-supplier=Future+Electronics; ComponentLink7URL: http://datasheet.octopart.com/YC164-JR-071KL-Yageo-datasheet-8326721.pdf?src-supplier=Element14; ComponentLink7Description: http://datasheet.octopart.com/YC164-JR-071KL-Yageo-datasheet-8326721.pdf?src-supplier=Element14; ComponentLink8URL: http://datasheet.octopart.com/YC164-JR-071KL-Yageo-datasheet-137701089.pdf?src-supplier=Future+Electronics; ComponentLink8Description: http://datasheet.octopart.com/YC164-JR-071KL-Yageo-datasheet-137701089.pdf?src-supplier=Future+Electronics; ComponentLink9URL: http://datasheet.octopart.com/YC164-JR-071KL-Yageo-datasheet-67645614.pdf?src-supplier=Element14; ComponentLink9Description: http://datasheet.octopart.com/YC164-JR-071KL-Yageo-datasheet-67645614.pdf?src-supplier=Element14; ComponentLink10URL: http://datasheet.octopart.com/YC164-JR-071KL-Yageo-datasheet-12517534.pdf?src-supplier=Future+Electronics; ComponentLink10Description: http://datasheet.octopart.com/YC164-JR-071KL-Yageo-datasheet-12517534.pdf?src-supplier=Future+Electronics; ComponentLink11URL: http://datasheet.octopart.com/YC164-JR-071KL-Yageo-datasheet-10911670.pdf; ComponentLink11Description: http://datasheet.octopart.com/YC164-JR-071KL-Yageo-datasheet-10911670.pdf; ComponentLink12URL: http://datasheet.octopart.com/YC164-JR-071KL-Yageo-datasheet-120102487.pdf?src-supplier=Megastar; ComponentLink12Description: http://datasheet.octopart.com/YC164-JR-071KL-Yageo-datasheet-120102487.pdf?src-supplier=Megastar; ComponentLink13URL: http://datasheet.octopart.com/YC164-JR-071KL-Yageo-datasheet-498984.pdf?src-supplier=Future+Electronics; ComponentLink13Description: http://datasheet.octopart.com/YC164-JR-071KL-Yageo-datasheet-498984.pdf?src-supplier=Future+Electronics; Supplier Part Number 1: 1K
R19-R22 = RC0603_49.9R: YAG5744CT-ND Res Thin Film 0603 49.9 Ohm 1% 1/10W ±50ppm/°C Molded SMD SMD Paper T/R; Manufacturer 1: Yageo; Manufacturer Part Number 1: RT0603FRE0749R9L; Power Rating: 100mW; Voltage Rating (DC): 50V; Voltage Rating: 75V; Supplier 1: Digi-Key; Stock 1: 18824; Pricing 1: 1=0.10000, 10=0.06500, 100=0.02650, 1000=0.01188, 2500=0.01031 (USD); Case/Package: 0603; Case Code (Imperial): 0603; Case Code (Metric): 1608; Contact Plating: Tin; Min Operating Temperature: -55°C; Max Operating Temperature: 125°C; Resistance: 49.9R; Tolerance: 1%; Packaging: Tape and Reel; Temperature Coefficient: 50ppm/°C; Composition: Thin Film; Military Standard: Not; Termination: SMD/SMT; Length: 1.6mm; Height: 0.45mm; Width: 0.8mm; Depth: 0.8mm; Radiation Hardening: No; Lead Free: Lead Free; ComponentLink1URL: https://datasheet.ciiva.com/12834/pyu-rt-1-to-0-05-rohs-l-4-12834153.pdf?src-supplier=Mouser; ComponentLink1Description: https://datasheet.ciiva.com/12834/pyu-rt-1-to-0-05-rohs-l-4-12834153.pdf?src-supplier=Mouser; ComponentLink2URL: http://datasheet.octopart.com/RT0603FRE0749R9L-Yageo-datasheet-86813807.pdf; ComponentLink2Description: http://datasheet.octopart.com/RT0603FRE0749R9L-Yageo-datasheet-86813807.pdf
RESET1 = SW-SMD: Switch; Published: 24-Mar-1999; LatestRevisionDate: 17-Jul-2002; LatestRevisionNote: Re-released for DXP Platform.; PackageReference: SPST-2; Publisher: Altium Limited
U3 = Widora: Widora MT7688; Manufacturer Part Number: Widora Bit 3 MT7688; Suppiler 1: China; Manufacturer: Widora; Suppiler Part Number 1: Widora Bit 3 MT7688
USB1 = USB-4: THT USB 2.0 A Connector WE-EPLE; Manufacturer: ASSMANN WSW Components; Manufacturer Part Number: A-USB A-E; Gender: Receptacle; Voltage Rating: 30V; Current Rating: 1A; Max Current Rating: 1.5A; Number of Contacts: 4; Number of Ports: 1; Pitch: 2mm; ComponentLink1Description: Manufacturer; ComponentLink1URL: http://www.we-online.de; ComponentLink2Description: Datasheet; ComponentLink2URL: http://www.we-online.de/katalog/media/pdf/8492121.pdf; Supplier 1: Digi-Key; Stock 1: 4089; Pricing 1: 1 = 0.90000, 10 = 0.78800, 25 = 0.74160, 50 = 0.71080, 100 = 0.67980, 250 = 0.61800, 500 = 0.55620, 1000 = 0.49440, 2500 = 0.44805 (USD); Mount: Through Hole; Contact Material: Bronze; Contact Plating: Gold; Number of Terminals: 4; Housing Material: Thermoplastic; Min Operating Temperature: -55°C; Max Operating Temperature: 85°C; Packaging: Bulk; Connector Type: USB; Termination: Solder; Orientation: Right Angle; Length: 7.2mm; Depth: 19.25mm; Lead Free: Lead Free; ComponentLink3URL: https://datasheet.ciiva.com/11731/0900766b80da421f-11731335.pdf?src-supplier=RSComponents; ComponentLink3Description: https://datasheet.ciiva.com/11731/0900766b80da421f-11731335.pdf?src-supplier=RSComponents; ComponentLink4URL: https://datasheet.ciiva.com/26945/getdatasheetpartid-786084-26945703.pdf?src-supplier=Verical; ComponentLink4Description: https://datasheet.ciiva.com/26945/getdatasheetpartid-786084-26945703.pdf?src-supplier=Verical